# EAGLE design DESIGN7IH (EAGLE 9.3.2)
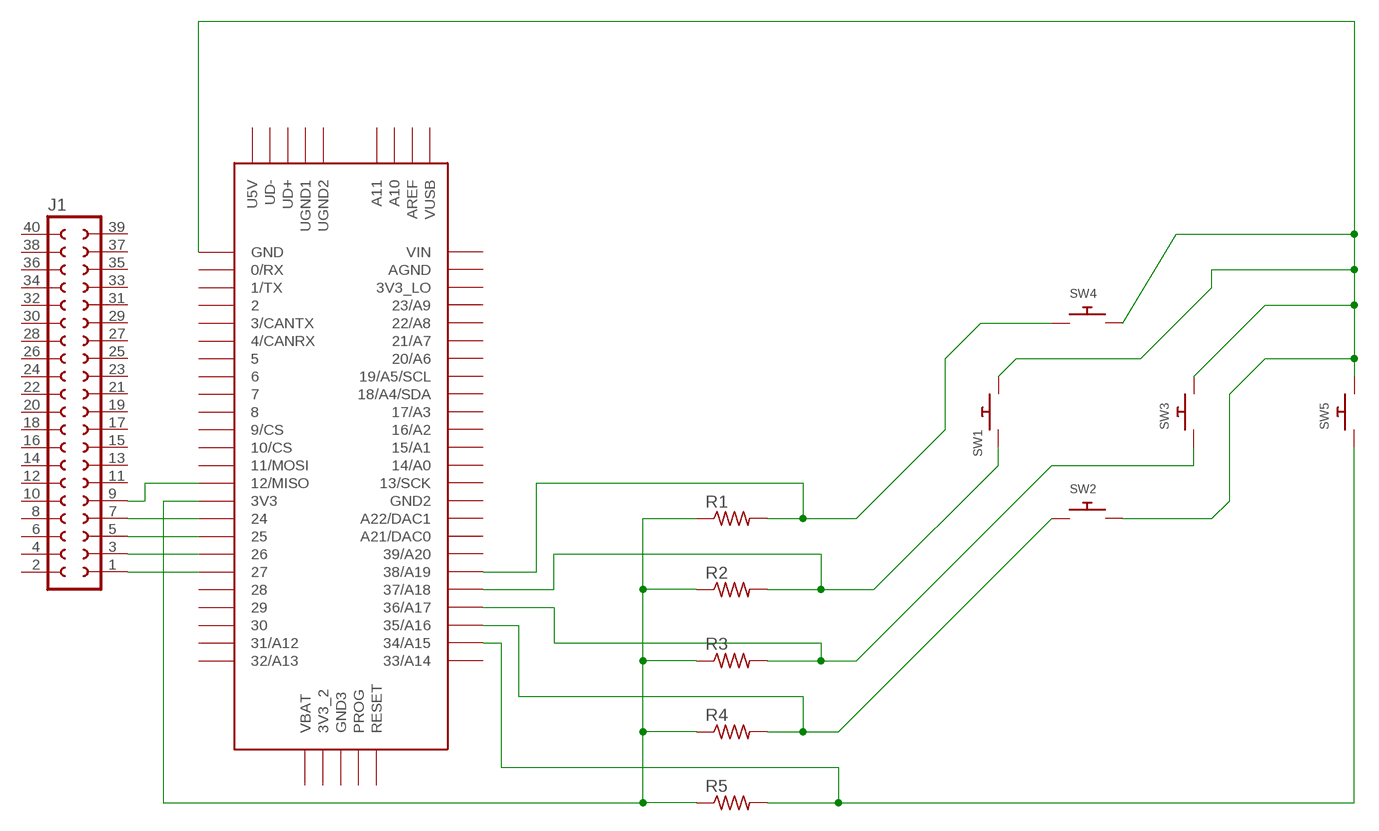
[diagram p0: schematic, sheet 1]

## Parts
J1  SOCKET-40V  [S40V]
R1  R-US_0204/5  [0204/5]
R2  R-US_0204/5  [0204/5]
R3  R-US_0204/5  [0204/5]
R4  R-US_0204/5  [0204/5]
R5  R-US_0204/5  [0204/5]
SW1  SWITCH_PUSHBUTTONEVQ-PE  [TACT_PANA-EVQ]
SW2  SWITCH_PUSHBUTTONEVQ-PE  [TACT_PANA-EVQ]
SW3  SWITCH_PUSHBUTTONEVQ-PE  [TACT_PANA-EVQ]
SW4  SWITCH_PUSHBUTTONEVQ-PE  [TACT_PANA-EVQ]
SW5  SWITCH_PUSHBUTTONEVQ-PE  [TACT_PANA-EVQ]
U$1  TEENSY_3.5/3.6  [TEENSY_3.5/3.6]

## Nets
N$1: R1.1 R2.1 R3.1 R4.1 R5.1 U$1.3V3
N$2: R5.2 SW5.P$1 U$1.34/A15
N$3: SW1.P$2 SW2.P$2 SW3.P$2 SW4.P$2 SW5.P$2 U$1.GND
N$4: R3.2 SW3.P$1 U$1.36/A17
N$5: R4.2 SW2.P$1 U$1.35/A16
N$6: R2.2 SW1.P$1 U$1.37/A18
N$7: R1.2 SW4.P$1 U$1.38/A19
N$8: J1.1 U$1.27
N$9: J1.3 U$1.26
N$10: J1.5 U$1.25
N$11: J1.7 U$1.24
N$12: J1.9 U$1.12/MISO
Unconnected: J1.2 J1.4 J1.6 J1.8 J1.10 J1.11 J1.12 J1.13 J1.14 J1.15 J1.16 J1.17 J1.18 J1.19 J1.20 J1.21 J1.22 J1.23 J1.24 J1.25 J1.26 J1.27 J1.28 J1.29 J1.30 J1.31 J1.32 J1.33 J1.34 J1.35 J1.36 J1.37 J1.38 J1.39 J1.40 U$1.0/RX U$1.1/TX U$1.2 U$1.3/CANTX U$1.3V3_2 U$1.3V3_LO U$1.4/CANRX U$1.5 U$1.6 U$1.7 U$1.8 U$1.9/CS U$1.10/CS U$1.11/MOSI U$1.13/SCK U$1.14/A0 U$1.15/A1 U$1.16/A2 U$1.17/A3 U$1.18/A4/SDA U$1.19/A5/SCL U$1.20/A6 U$1.21/A7 U$1.21/DAC0(A21/DAC0) U$1.22/A8 U$1.23/A9 U$1.28 U$1.29 U$1.30 U$1.31/A12 U$1.32/A13 U$1.33/A14 U$1.39/A20 U$1.A10 U$1.A11 U$1.A22/DAC1 U$1.AGND U$1.AREF U$1.GND2 U$1.GND3 U$1.PROG U$1.RESET U$1.U5V U$1.UD+ U$1.UD- U$1.UGND1 U$1.UGND2 U$1.VBAT U$1.VIN U$1.VUSB

## Library data of the parts
J1 = con-3m-skt-header:SOCKET-40: 40 pin PCB Socket (3m 85xx/51xx)
R1-R5 = adafruit:R-US_: RESISTOR, American symbol
SW1-SW5 = adafruit:SWITCH_PUSHBUTTON: Buttons SOFTTOUCHSMD_SJ - Soft touch temporary push button (Super Junk Akihabara) Compatible with SKPMANE010 [Mouser: 688-SKPMAN] C&K_KSS = Digikey: KSS221GLFS
U$1 = Teensy356:TEENSY_3.5/3.6

## Board
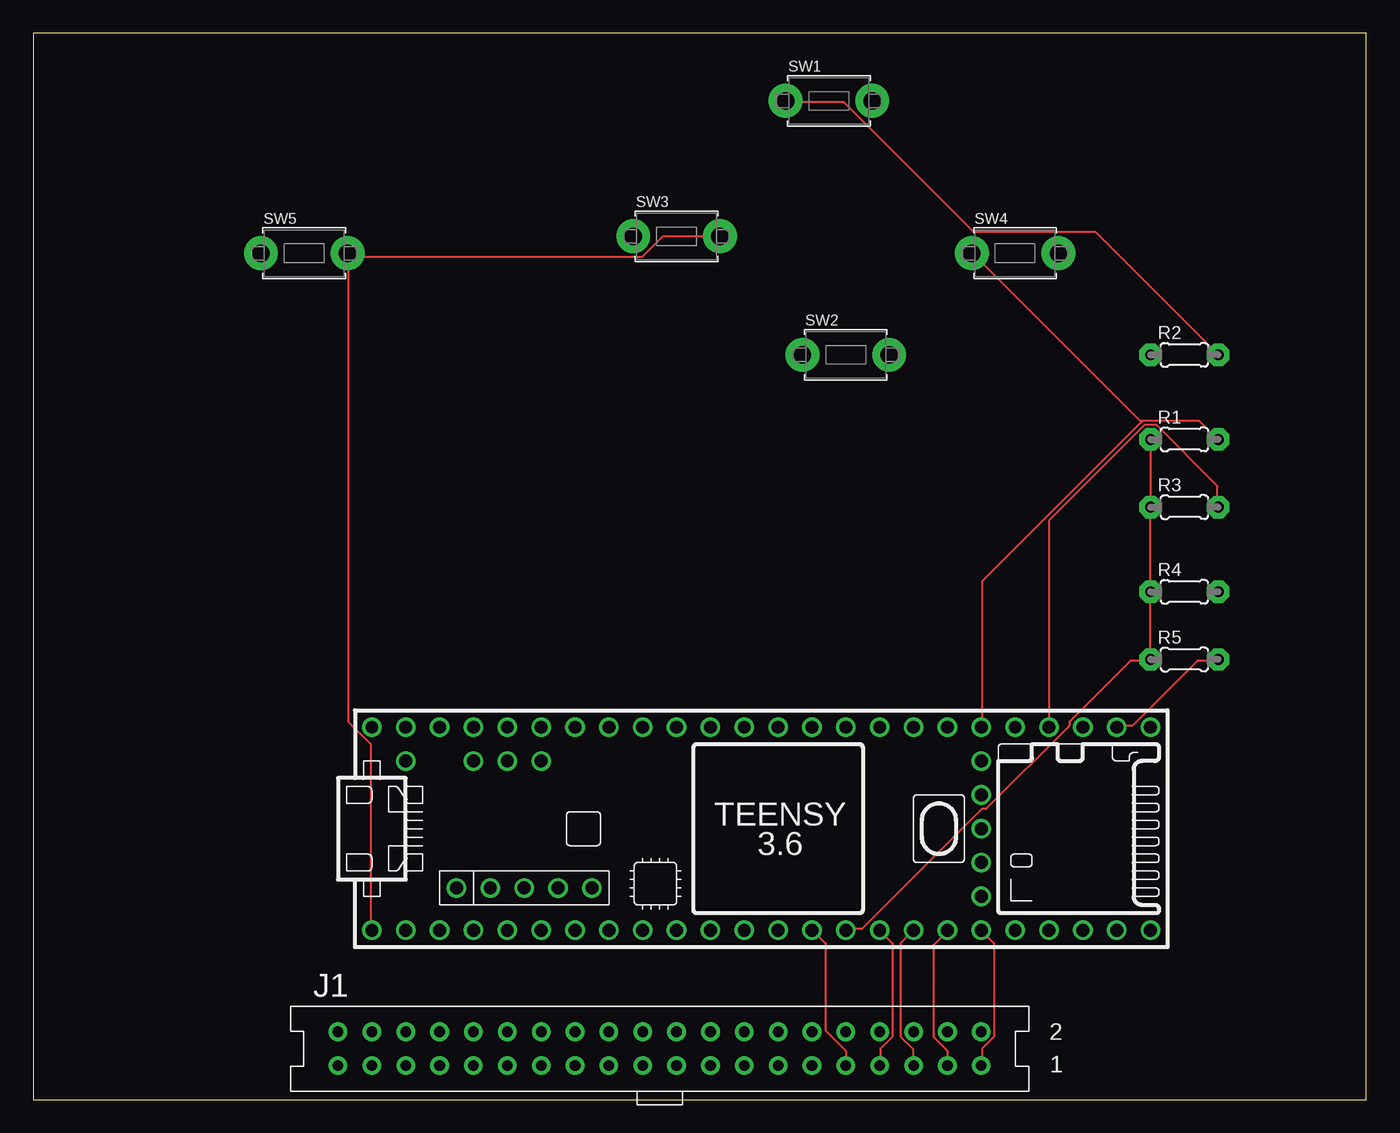
[diagram p1: board, top side]
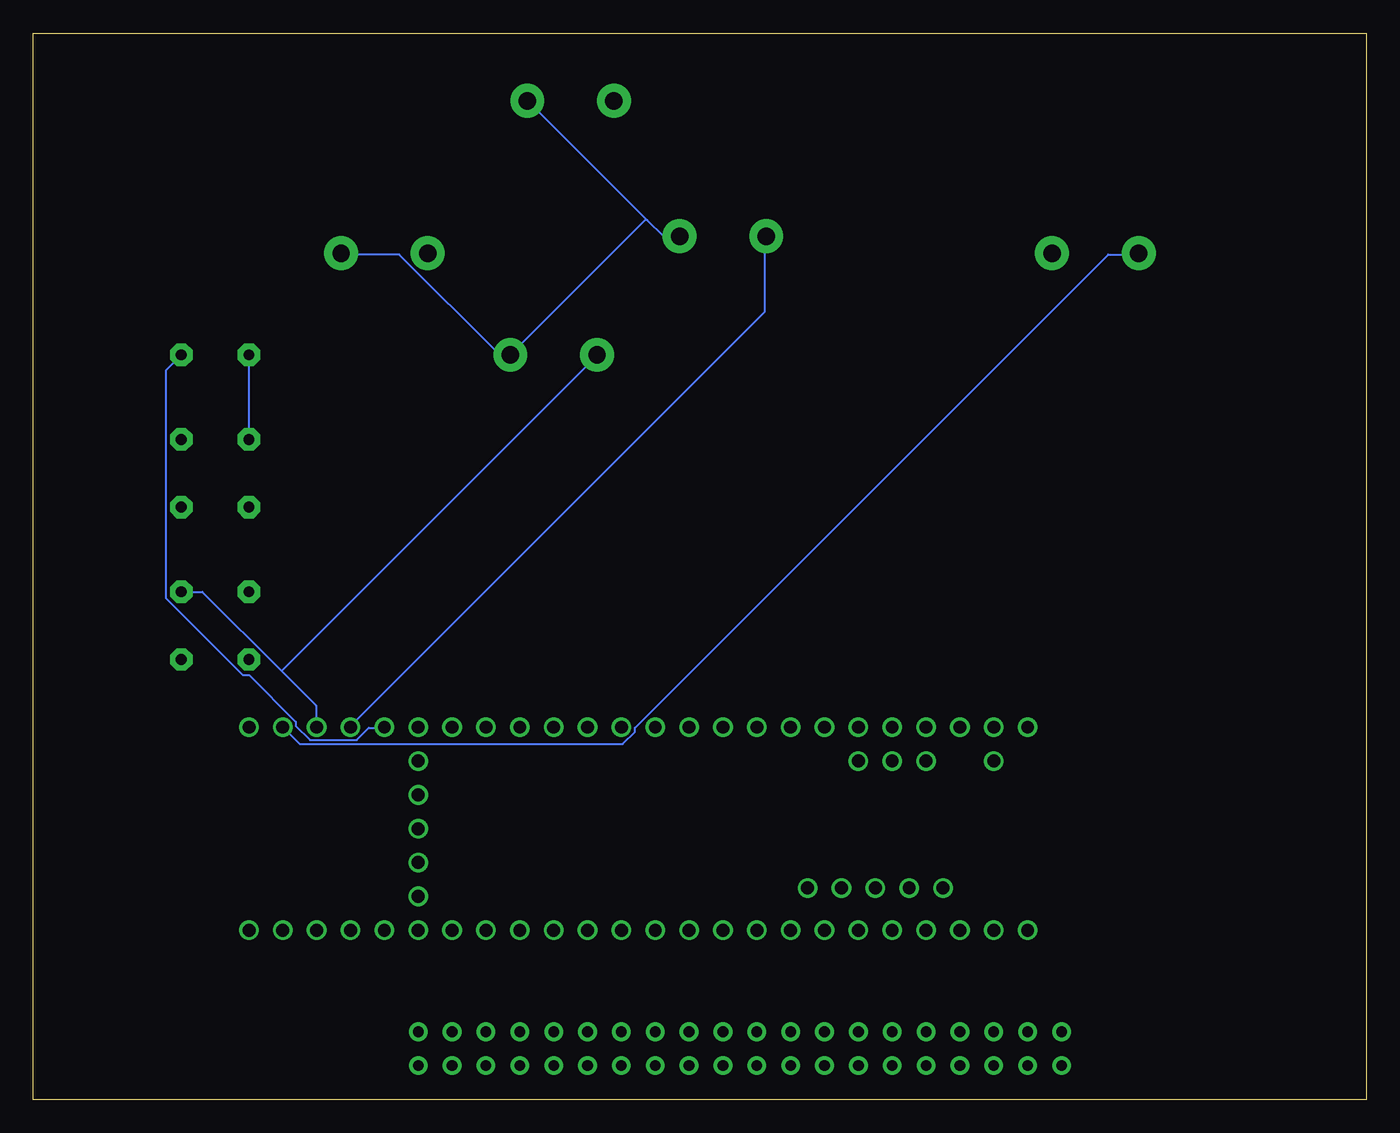
[diagram p2: board, bottom side, seen from below]

Size 100 x 80 mm. Coordinates in mm from the lower left corner, seen from the top.
Outline: 0,0 100,0 100,80 0,80 0,0
Copper layers (1*16): Top 0.035mm / dielectric 1.5mm / Bottom 0.035mm
Design rules "default": minimum track width 6mil, minimum drill 0.35mm, track to track 6mil, track to pad 6mil, pad to pad 6mil, via to via 6mil, smd to smd 6mil, copper to edge 40mil, drill to drill 6mil, minimum pad ring 10mil, minimum via ring 8mil, stop-mask expansion 4mil, vias tented up to drill 0mil, thermal gap 10mil

### Footprints (pad centres in the part's own frame; a part is rotated, then mirrored left to right if it is on the bottom)
S40V = drill 0.8 pad 1.4: 1 24.13,-1.27; 2 24.13,1.27; 3 21.59,-1.27; 4 21.59,1.27; 5 19.05,-1.27; 6 19.05,1.27; 7 16.51,-1.27; 8 16.51,1.27; 9 13.97,-1.27; 10 13.97,1.27; 11 11.43,-1.27; 12 11.43,1.27; 13 8.89,-1.27; 14 8.89,1.27; 15 6.35,-1.27; 16 6.35,1.27; 17 3.81,-1.27; 18 3.81,1.27; 19 1.27,-1.27; 20 1.27,1.27; 21 -1.27,-1.27; 22 -1.27,1.27; 23 -3.81,-1.27; 24 -3.81,1.27; 25 -6.35,-1.27; 26 -6.35,1.27; 27 -8.89,-1.27; 28 -8.89,1.27; 29 -11.43,-1.27; 30 -11.43,1.27; 31 -13.97,-1.27; 32 -13.97,1.27; 33 -16.51,-1.27; 34 -16.51,1.27; 35 -19.05,-1.27; 36 -19.05,1.27; 37 -21.59,-1.27; 38 -21.59,1.27; 39 -24.13,-1.27; 40 -24.13,1.27
0204/5 = drill 0.813 pad 1.676 octagon: 1 -2.54,0; 2 2.54,0
TACT_PANA-EVQ = drill 1.3 pad 2.54: P$1 -3.25,0; P$2 3.25,0
TEENSY_3.5/3.6 = drill 0.965: 0/RX -25.4,-7.62; 1/TX -22.86,-7.62; 2 -20.32,-7.62; 3/CANTX -17.78,-7.62; 3V3 7.62,-7.62; 3V3_2 17.78,-2.54; 3V3_LO -22.86,7.62; 4/CANRX -15.24,-7.62; 5 -12.7,-7.62; 6 -10.16,-7.62; 7 -7.62,-7.62; 8 -5.08,-7.62; 9/CS -2.54,-7.62; 10/CS 0,-7.62; 11/MOSI 2.54,-7.62; 12/MISO 5.08,-7.62; 13/SCK 5.08,7.62; 14/A0 2.54,7.62; 15/A1 0,7.62; 16/A2 -2.54,7.62; 17/A3 -5.08,7.62; 18/A4/SDA -7.62,7.62; 19/A5/SCL -10.16,7.62; 20/A6 -12.7,7.62; 21/A7 -15.24,7.62; 21/DAC0 12.7,7.62; 22/A8 -17.78,7.62; 23/A9 -20.32,7.62; 24 10.16,-7.62; 25 12.7,-7.62; 26 15.24,-7.62; 27 17.78,-7.62; 28 20.32,-7.62; 29 22.86,-7.62; 30 25.4,-7.62; 31/A12 27.94,-7.62; 32/A13 30.48,-7.62; 33/A14 30.48,7.62; 34/A15 27.94,7.62; 35/A16 25.4,7.62; 36/A17 22.86,7.62; 37/A18 20.32,7.62; 38/A19 17.78,7.62; 39/A20 15.24,7.62; A10 -17.78,5.08; A11 -15.24,5.08; A22/DAC1 10.16,7.62; AGND -25.4,7.62; AREF -20.32,5.08; GND -27.94,-7.62; GND2 7.62,7.62; GND3 17.78,0; PROG 17.78,2.54; RESET 17.78,5.08; U5V -21.59,-4.445; UD+ -16.51,-4.445; UD- -19.05,-4.445; UGND1 -13.97,-4.445; UGND2 -11.43,-4.445; VBAT 17.78,-5.08; VIN -27.94,7.62; VUSB -25.4,5.08

### Placement (x,y rotation side)
J1  46.99,3.81 0 top
R1  86.36,49.53 0 top
R2  86.36,55.88 0 top
R3  86.36,44.45 0 top
R4  86.36,38.1 0 top
R5  86.36,33.02 0 top
SW1  59.69,74.93 0 top
SW2  60.96,55.88 0 top
SW3  48.26,64.77 0 top
SW4  73.66,63.5 0 top
SW5  20.32,63.5 0 top
U$1  53.34,20.32 0 top

### Tracks (layer width: path | path; a pad name or v marks a point on that pad's centre or on a via)
N$1
  Top 0.152: R1.1 R3.1 R4.1 R5.1 83.82,32.92 82.3,32.92 77.72,28.35 77.72,28.04 71.48,21.79 71.17,21.79 62.18,12.8 60.96,12.8 U$1.3V3
  Bottom 0.152: R1.1 R2.1
N$2
  Top 0.152: U$1.34/A15 81.38,28.04 82.45,28.04 87.33,32.92 88.85,32.92 R5.2
  Bottom 0.152: U$1.34/A15 80.01,26.67 55.78,26.67 54.86,27.58 54.86,27.89 19.36,63.4 17.22,63.4 SW5.P$1
N$3
  Top 0.152: 23.62,63.25 23.62,63.4 SW5.P$2 23.62,63.25 | 23.62,63.25 23.62,28.35 25.3,26.67 25.3,12.8 U$1.GND | SW3.P$2 47.24,64.77 45.72,63.25 23.62,63.25
  Bottom 0.152: SW3.P$2 52.73,64.77 53.95,65.99 | 53.95,65.99 62.79,74.83 SW1.P$2 | 53.95,65.99 54.1,65.99 64.16,55.93 SW2.P$2 64.31,55.93 65.08,55.93 72.54,63.4 76.81,63.4 SW4.P$2
N$4
  Top 0.152: U$1.36/A17 76.2,43.43 83.36,50.6 84.28,50.6 88.85,46.02 88.85,44.5 R3.2
  Bottom 0.152: SW3.P$1 45.11,64.77 45.11,59.13 76.2,28.04 U$1.36/A17
N$5
  Bottom 0.152: 81.38,32.16 87.33,38.1 R4.2 | 81.38,32.16 78.79,29.57 78.79,28.04 U$1.35/A16 | 81.38,32.16 57.76,55.78 SW2.P$1
N$6
  Top 0.152: R2.2 79.7,65.08 70.56,65.08 60.81,74.83 56.54,74.83 SW1.P$1
  Bottom 0.152: R2.2 90.07,54.71 90.07,37.64 84.28,31.85 83.82,31.85 80.31,28.35 80.31,28.04 79.25,26.98 75.74,26.98 74.83,27.89 73.76,27.89 U$1.37/A18
N$7
  Top 0.152: 83.21,50.9 71.17,38.86 71.17,28.04 U$1.38/A19 | 83.21,50.9 87.48,50.9 88.85,49.53 R1.2 | 83.21,50.9 83.06,50.9 70.56,63.4 SW4.P$1
N$8
  Top 0.152: U$1.27 72.08,11.73 72.08,4.72 71.17,3.81 71.17,2.59 J1.1
N$9
  Top 0.152: J1.3 68.58,3.66 67.51,4.72 67.51,11.58 68.58,12.65 U$1.26
N$10
  Top 0.152: U$1.25 65.08,11.73 65.08,4.72 65.99,3.81 65.99,2.59 J1.5
N$11
  Top 0.152: U$1.24 64.47,11.73 64.47,4.72 63.55,3.81 63.55,2.59 J1.7
N$12
  Top 0.152: J1.9 60.96,3.66 59.44,5.18 59.44,11.73 58.52,12.65 U$1.12/MISO